# EAGLE design fridge-p12f675 (EAGLE 6.1)
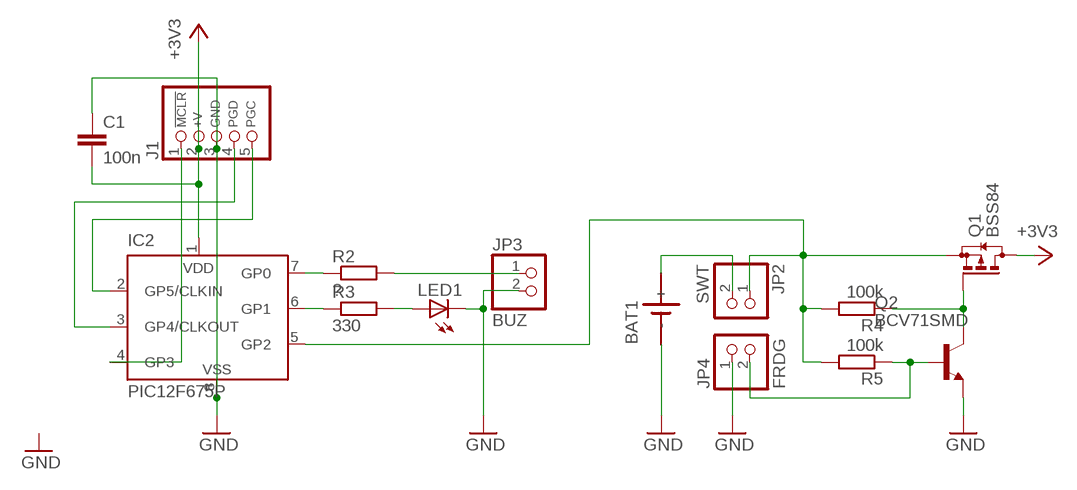
[diagram p0: schematic, sheet 1]

## Parts
BAT1  SN2032  [SN2032]
C1  100n  C-EUC0805K  [C0805K]
IC2  PIC12F675P  [DIL8]
J1  CON_HEADER_PRG_PIC_ICSP0.1INCH_A  [HEADER_PRG_1X05]
JP2  SWT  PINHD-1X2  [1X02]
JP3  BUZ  PINHD-1X2  [1X02]
JP4  FRDG  PINHD-1X2  [1X02]
LED1  LEDCHIPLED_0805  [CHIPLED_0805]
Q1  BSS84  [SOT23]
Q2  BCV71SMD  [SOT23-BEC]
R2  ?  R-EU_R0805  [R0805]
R3  330  R-EU_R0805  [R0805]
R4  100k  R-EU_R0805  [R0805]
R5  100k  R-EU_R0805  [R0805]

## Nets
+3V3: C1.2 IC2.1(VDD) J1.2(+V) Q1.3(D)
GND: BAT1.- C1.1 IC2.8(VSS) J1.3(GND) JP3.2 JP4.1 LED1.C Q2.E
N$1: BAT1.+ JP2.2
N$2: IC2.7(GP0) R2.1
N$3: IC2.6(GP1) R3.1
N$4: LED1.A R3.2
N$5: JP3.1 R2.2
N$7: IC2.5(GP2) JP2.1 Q1.2(S) R4.2 R5.2
N$9: JP4.2 Q2.B R5.1
N$10: Q1.1(G) Q2.C R4.1
N$13: IC2.2(GP5/CLKIN) J1.5(PGC)
N$14: IC2.3(GP4/CLKOUT) J1.4(PGD)
N$15: IC2.4(GP3) J1.1(/MCLR)

## Library data of the parts
BAT1 = sn2032:SN2032: LI BATTERY
C1 = rcl:C-EU: CAPACITOR, European symbol
IC2 = microchip:PIC12F6*: Data Sheet 8-Pin FLASH-Based 8-Bit CMOS Microcontrollers Source: http://www.microchip.com .. 41190c.pdf; MF: MICROCHIP; MPN: PIC12F675-E/P; OC_FARNELL: 9759018; OC_NEWARK: 92C4340
J1 = dp_devices:CON_HEADER_PRG_PIC_ICSP: 5-pin PIC In Circuit Serial Programming header
JP2-JP4 = pinhead:PINHD-1X2: PIN HEADER
LED1 = led:LED: LED OSRAM: - CHIPLED LG R971, LG N971, LY N971, LG Q971, LY Q971, LO R971, LY R971 LH N974, LH R974 LS Q976, LO Q976, LY Q976 LO Q996 - Hyper CHIPLED LW Q18S LB Q993, LB Q99A, LB R99A - SideLED LS A670, LO A670, LY A670, LG A670, LP A670 LB A673, LV A673, LT A673, LW A673 LH A674 LY A675 LS A676, LA A676, LO A676, LY A676, LW A676 LS A679, LY A679, LG A679 - Hyper Micro SIDELED® LS Y876, LA Y876, LO Y876, LY Y876 LT Y87S - SmartLED LW L88C, LW L88S LB L89C, LB L89S, LG L890 LS L89K, LO L89K, LY L89K LS L896, LA L896, LO L896, LY L896 - TOPLED LS T670, LO T670, LY T670, LG T670, LP T670 LSG T670, LSP T670, LSY T670, LOP T670, LYG T670 LG T671, LOG T671, LSG T671 LB T673, LV T673, LT T673, LW T673 LH T674 LS T676, LA T676, LO T676, LY T676, LB T676, LH T676, LSB T676, LW T676 LB T67C, LV T67C, LT T67C, LS T67K, LO T67K, LY T67K, LW E67C LS E67B, LA E67B, LO E67B, LY E67B, LB E67C, LV E67C, LT E67C LW T67C LS T679, LY T679, LG T679 LS T770, LO T770, LY T770, LG T770, LP T770 LB T773, LV T773, LT T773, LW T773 LH T774 LS E675, LA E675, LY E675, LS T675 LS T776, LA T776, LO T776, LY T776, LB T776 LHGB T686 LT T68C, LB T68C - Hyper Mini TOPLED® LB M676 - Mini TOPLED Santana® LG M470 LS M47K, LO M47K, LY M47K Source: http://www.osram.convergy.de LUXEON: - LUMILED® LXK2-PW12-R00, LXK2-PW12-S00, LXK2-PW14-U00, LXK2-PW14-V00 LXK2-PM12-R00, LXK2-PM12-S00, LXK2-PM14-U00 LXK2-PE12-Q00, LXK2-PE12-R00, LXK2-PE12-S00, LXK2-PE14-T00, LXK2-PE14-U00 LXK2-PB12-K00, LXK2-PB12-L00, LXK2-PB12-M00, LXK2-PB14-N00, LXK2-PB14-P00, LXK2-PB14-Q00 LXK2-PR12-L00, LXK2-PR12-M00, LXK2-PR14-Q00, LXK2-PR14-R00 LXK2-PD12-Q00, LXK2-PD12-R00, LXK2-PD12-S00 LXK2-PH12-R00, LXK2-PH12-S00 LXK2-PL12-P00, LXK2-PL12-Q00, LXK2-PL12-R00 Source: www.luxeon.com KINGBRIGHT: KA-3528ASYC Source: www.kingbright.com
Q1 = transistor-small-signal:BSS84: P-CHANNEL MOS FET
Q2 = transistor-npn:BCV71*: NPN Transistor
R2-R5 = rcl:R-EU_: RESISTOR, European symbol

## Board
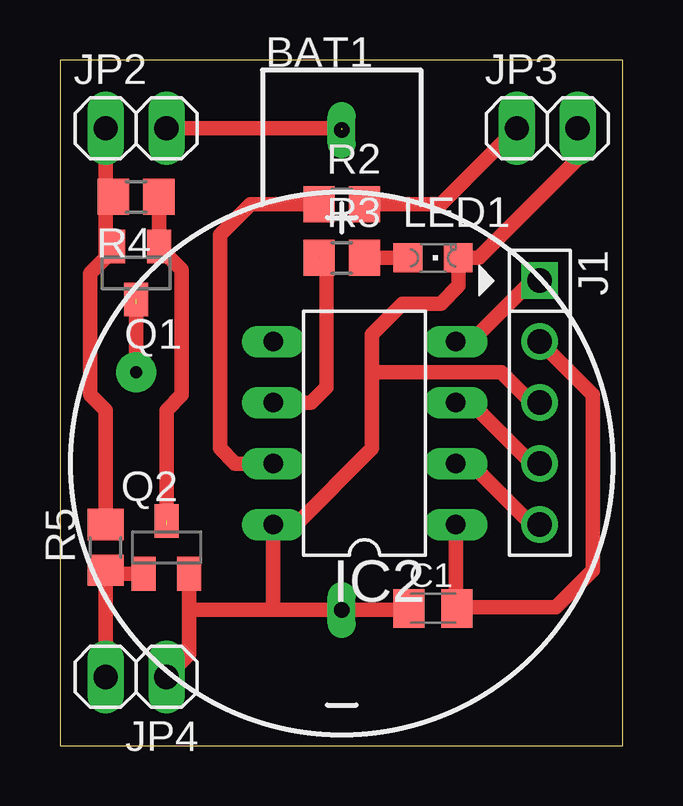
[diagram p1: board, top side]
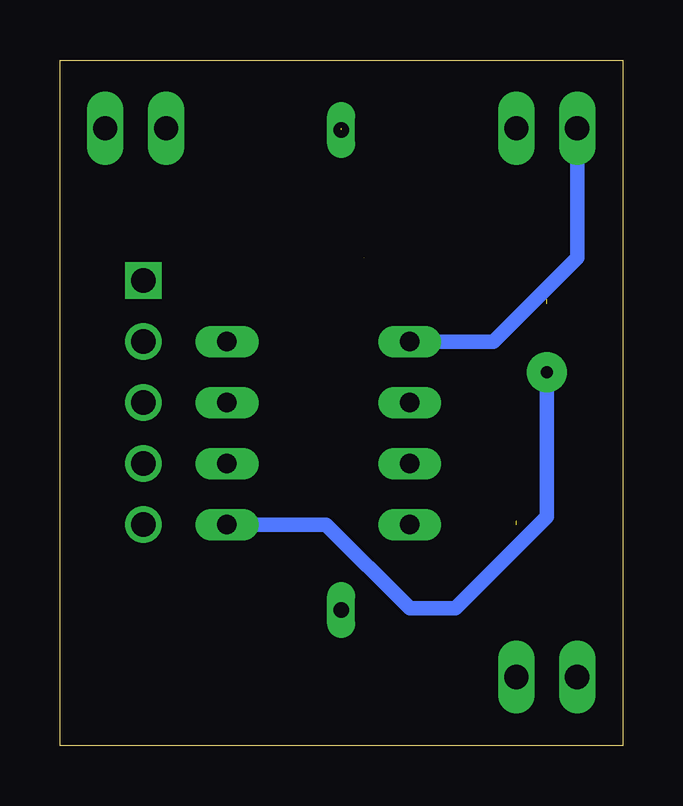
[diagram p2: board, bottom side, seen from below]

Size 23.48 x 28.56 mm. Coordinates in mm from the lower left corner, seen from the top.
Outline: 0,0 23.48,0 23.48,28.56 0,28.56 0,0
Copper layers (1*16): Top 0.035mm / dielectric 1.5mm / Bottom 0.035mm
Design rules: minimum track width 10mil, minimum drill 24mil, track to track 12mil, track to pad 12mil, pad to pad 12mil, via to via 12mil, smd to smd 10mil, copper to edge 12mil, drill to drill 12mil, minimum pad ring 10mil, minimum via ring 10mil, stop-mask expansion 4mil, vias tented up to drill 0mil, thermal gap 12mil

### Footprints (pad centres in the part's own frame; a part is rotated, then mirrored left to right if it is on the bottom)
SN2032 = drill 0.65 long: + 0,13.9; - 0,-6.1
C0805K = smd 1.3 x 1.6: 1 -1,0; 2 1,0
DIL8 = drill 0.813 long: 1 -3.81,-3.81; 2 -1.27,-3.81; 3 1.27,-3.81; 4 3.81,-3.81; 5 3.81,3.81; 6 1.27,3.81; 7 -1.27,3.81; 8 -3.81,3.81
HEADER_PRG_1X05 = drill 1.016 square: 1 -5.08,0 | drill 1.016: 2 -2.54,0; 3 0,0; 4 2.54,0; 5 5.08,0
1X02 = drill 1.016 long: 1 -1.27,0; 2 1.27,0
CHIPLED_0805 = smd 1.2 x 1.2: A 0,-1.05; C 0,1.05
SOT23 = smd 1 x 1.4: 1 -0.95,-1.1; 2 0.95,-1.1; 3 0,1.1
SOT23-BEC = smd 1 x 1.4: B -0.95,-1.1; C 0,1.1; E 0.95,-1.1
R0805 = smd 1.3 x 1.5: 1 -0.95,0; 2 0.95,0

### Placement (x,y rotation side)
BAT1  11.75,11.75 0 top
C1  15.56,5.71 0 top
IC2  12.7,13.02 90 top
J1  20,14.29 270 top
JP2  3.17,25.72 0 top
JP3  20.32,25.72 0 top
JP4  3.17,2.86 180 top
LED1  15.56,20.32 270 top
Q1  3.17,19.68 180 top
Q2  4.45,8.26 0 top
R2  11.75,22.54 0 top
R3  11.75,20.32 0 top
R4  3.17,22.86 180 top
R5  1.91,8.26 90 top

### Tracks (layer width: path | path; a pad name or v marks a point on that pad's centre or on a via)
+3V3  (via drill 0.5 pad 1.68)  (1 unrouted)
  Top 0.61: v3.17,15.56 3.17,18.41 | 16.51,5.76 IC2.1 | 16.51,5.76 C1.2 | 16.51,5.76 20.68,5.76 22.23,7.3 22.23,14.61 J1.2
  Bottom 0.61: v3.17,15.56 3.17,9.53 6.99,5.71 8.89,5.71 12.38,9.21 IC2.1
GND
  Top 0.61: Q2.E 5.39,5.71 | 5.39,5.71 5.39,3.81 JP4.1 | 8.89,5.65 BAT1.- 14.49,5.65 C1.1 | 8.89,5.65 5.46,5.65 5.39,5.71 | 8.89,5.65 IC2.8 9.84,9.21 13.02,12.38 13.02,15.56 | 13.02,15.56 13.02,17.14 14.29,18.41 15.88,18.41 16.61,19.15 LED1.C 17.46,20.32 21.59,24.45 JP3.2 | 13.02,15.56 18.41,15.56 19.68,14.29 J1.3
N$1  (1 unrouted)
  Top 0.61: JP2.2 11.75,25.72
N$2
  Top 0.61: IC2.7 7.3,11.75 6.67,12.38 6.67,21.27 7.94,22.54 R2.1
N$3  (1 unrouted)
  Top 0.61: IC2.6 10.48,14.29 11.11,14.92 11.11,20 R3.1
N$4
  Top 0.61: R3.2 LED1.A
N$5
  Top 0.61: R2.2 15.88,22.54 JP3.1
N$7
  Top 0.61: JP2.1 1.91,22.86 | 1.91,22.86 1.91,20.64 | 1.91,20.64 1.91,20.32 1.27,19.68 1.27,14.61 1.91,13.97 R5.2 | R4.2 1.91,22.86 | Q1.2 2.05,20.79 1.91,20.64
  Bottom 0.61: IC2.5 5.4,16.83 1.91,20.32 JP2.1
N$9
  Top 0.61: Q2.B 2.05,7.16 | 2.05,7.16 1.91,6.99 JP4.2 | R5.1 2.05,7.16
N$10  (1 unrouted)
  Top 0.61: 4.45,9.21 4.45,13.97 5.08,14.61 5.08,19.83 Q1.1 4.12,21.27 | 4.12,21.27 R4.1 | 4.12,21.27 R4.1
N$13
  Top 0.61: IC2.2 17.14,11.75 19.68,9.21 J1.5
N$14
  Top 0.61: IC2.3 17.14,14.29 19.68,11.75 J1.4
N$15
  Top 0.61: IC2.4 17.14,16.83 19.68,19.37 J1.1